# Altium project RFSoC-AMC.PrjPCB (part 2 of 22)

## Sheet DDR4_SDRAM.SchDoc: RFSoC AMC
size 420 x 297 mm; CompanyName: WUT; DrawnBy: T. Przywozki; Organization: WUT ISE; Address1: Warsaw University of Technology; Address2: Nowowiejska 15/19 00-665 Warsaw; Address3: Tomasz.Przywozki@pw.edu.pl; DocumentNumber: 14; Revision: 1; SheetNumber: 14; SheetTotal: 45; Project: RFSoC AMC; ModifiedBy: T. Przywozki; CreateDate: -; CheckedDate: -; DivGrp: ISE; Designer: T. Przywozki; ModifiedDate: -; ProjectName: ADC/DAC MEZZANINE
Used 3 times, as channels U_DDR4_SDRAM_PL1, U_DDR4_SDRAM_PL2, U_DDR4_SDRAM_PS. Parts and nets are listed once, with the designators drawn on the sheet.
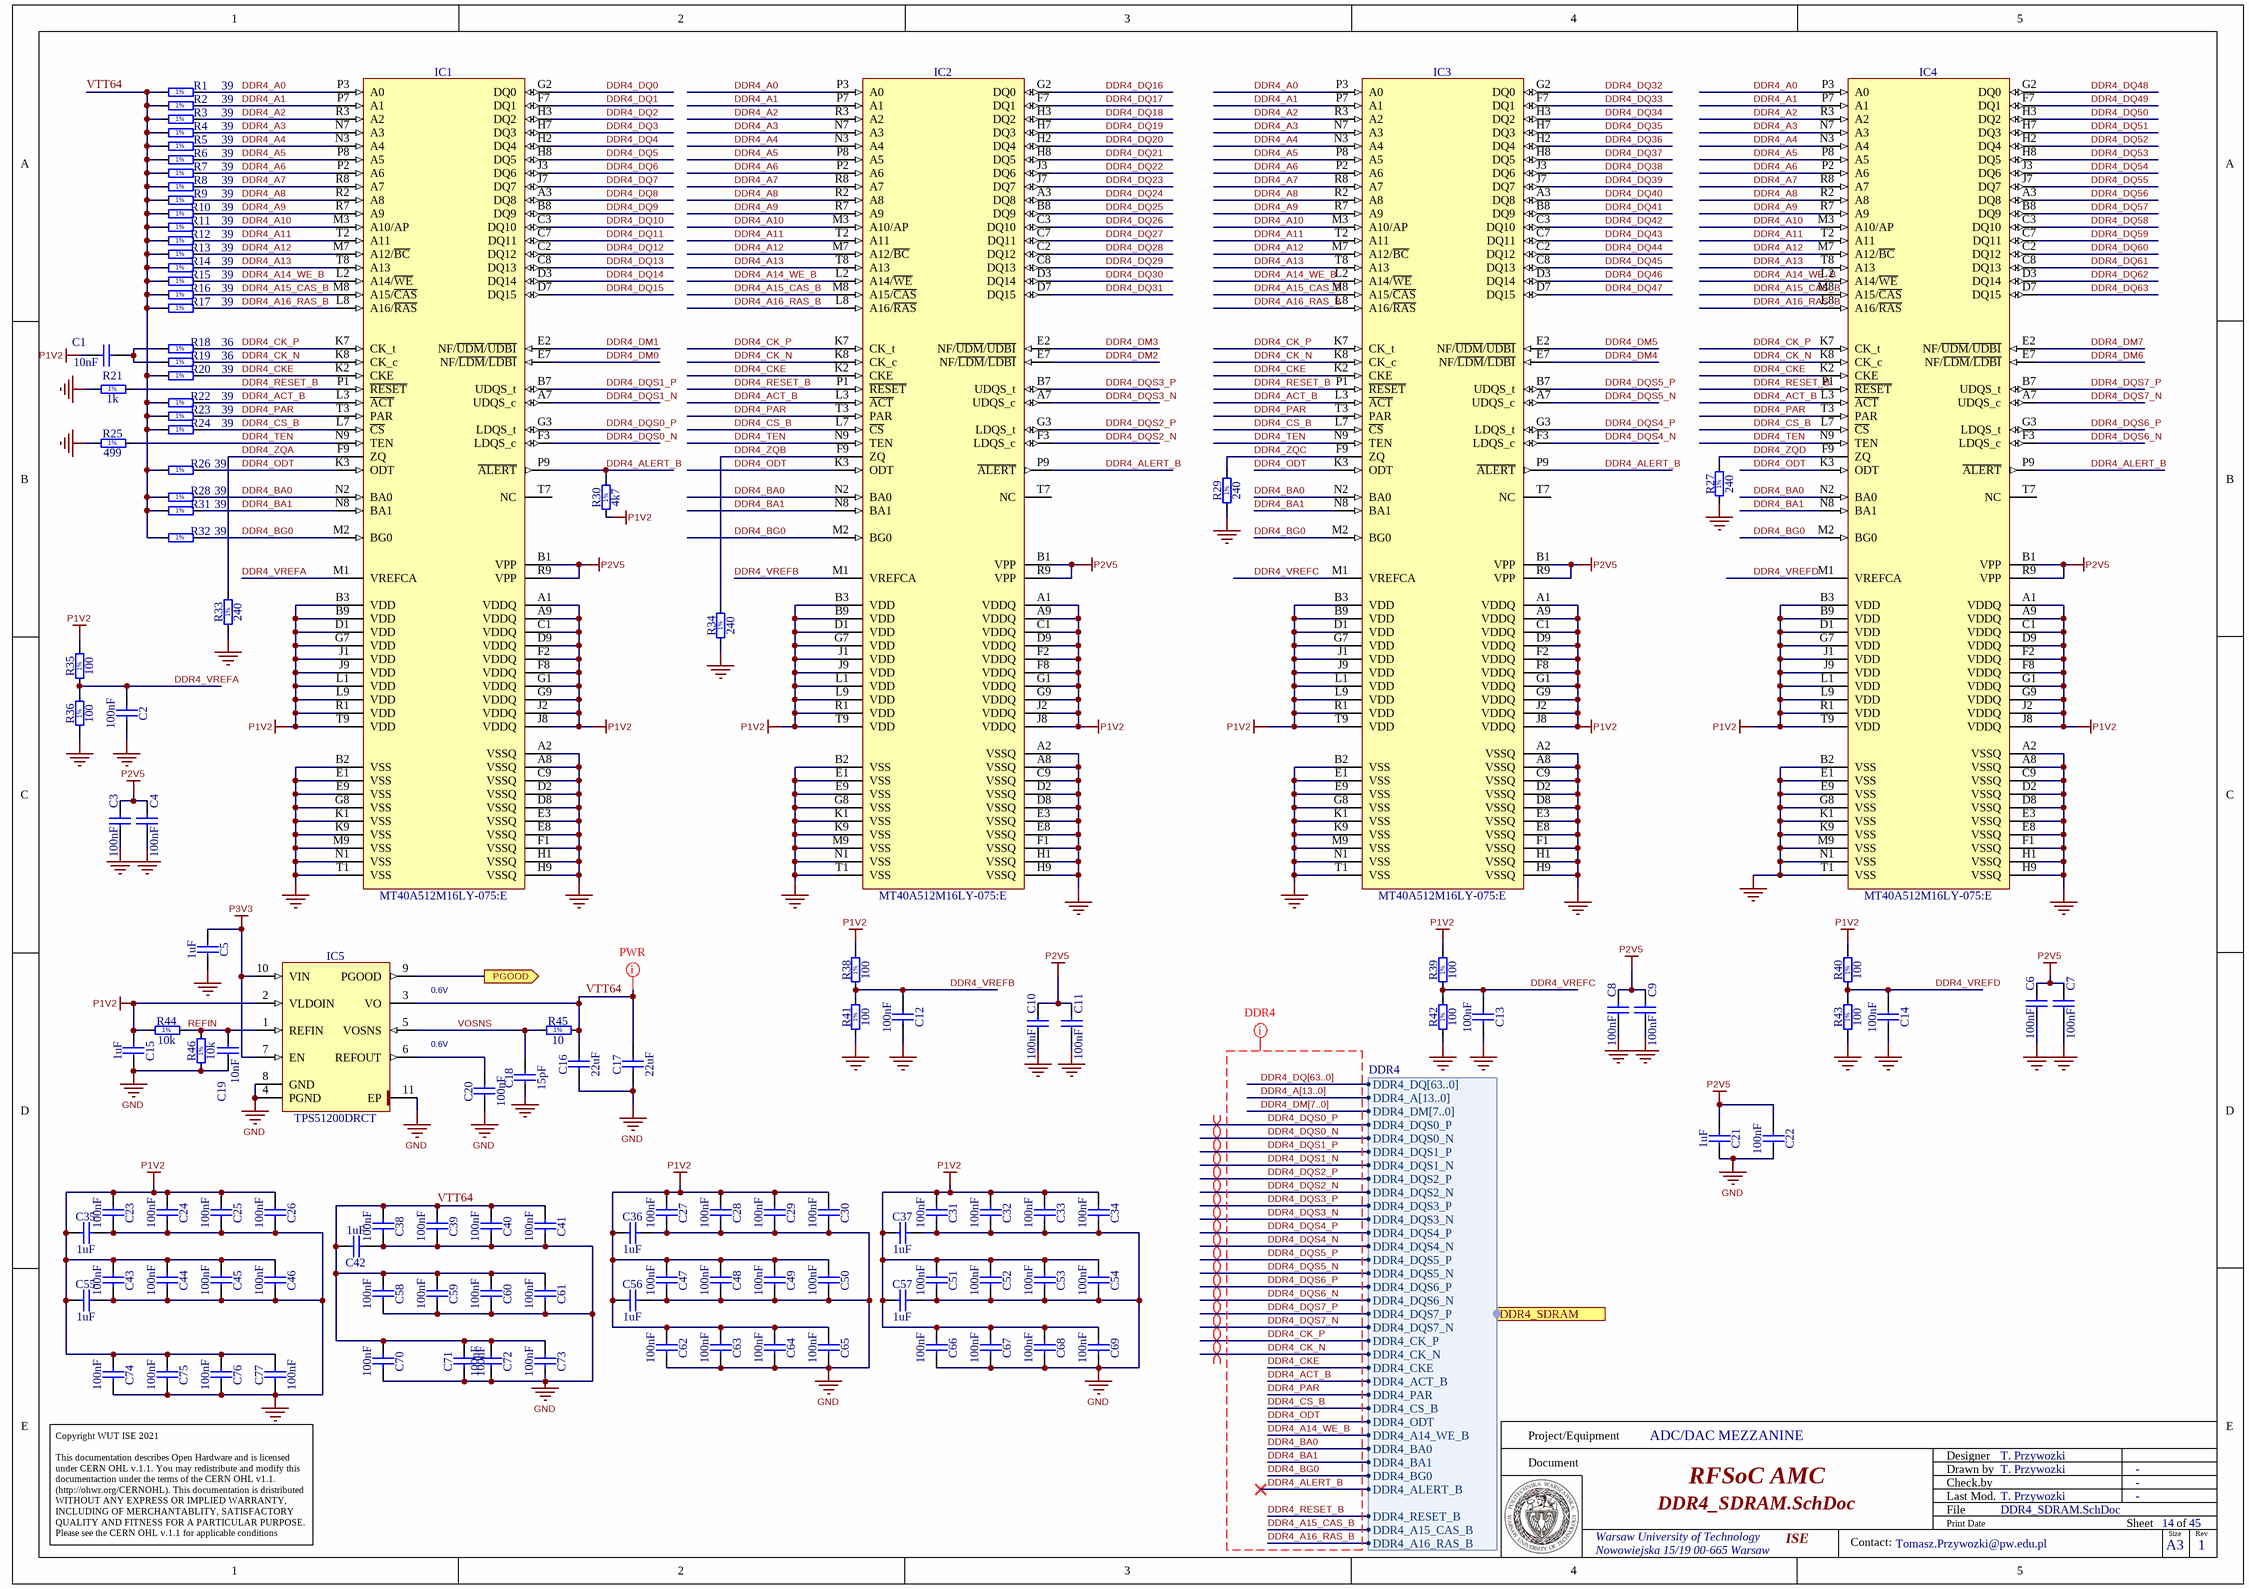
[diagram p2: DDR4_SDRAM.SchDoc]

### Parts
C1  10nF  [CAPC0603X33N]
C2  100nF  [CAPC0603X33N]
C3  100nF  [CAPC0603X33N]
C4  100nF  [CAPC0603X33N]
C5  1uF  [CAPC1005X55N]
C6  100nF  [CAPC0603X33N]
C7  100nF  [CAPC0603X33N]
C8  100nF  [CAPC0603X33N]
C9  100nF  [CAPC0603X33N]
C10  100nF  [CAPC0603X33N]
C11  100nF  [CAPC0603X33N]
C12  100nF  [CAPC0603X33N]
C13  100nF  [CAPC0603X33N]
C14  100nF  [CAPC0603X33N]
C15  1uF  [CAPC1005X55N]
C16  22uF  [CAPC2012X135N]
C17  22uF  [CAPC2012X135N]
C18  15pF  [CAPC1005X55N]
C19  10nF  [CAPC1005X55N]
C20  100nF  [CAPC0603X33N]
C21  1uF  [CAPC1005X55N]
C22  100nF  [CAPC0603X33N]
C23  100nF  [CAPC0603X33N]
C24  100nF  [CAPC0603X33N]
C25  100nF  [CAPC0603X33N]
C26  100nF  [CAPC0603X33N]
C27  100nF  [CAPC0603X33N]
C28  100nF  [CAPC0603X33N]
C29  100nF  [CAPC0603X33N]
C30  100nF  [CAPC0603X33N]
C31  100nF  [CAPC0603X33N]
C32  100nF  [CAPC0603X33N]
C33  100nF  [CAPC0603X33N]
C34  100nF  [CAPC0603X33N]
C35  1uF  [CAPC1005X55N]
C36  1uF  [CAPC1005X55N]
C37  1uF  [CAPC1005X55N]
C38  100nF  [CAPC0603X33N]
C39  100nF  [CAPC0603X33N]
C40  100nF  [CAPC0603X33N]
C41  100nF  [CAPC0603X33N]
C42  1uF  [CAPC1005X55N]
C43  100nF  [CAPC0603X33N]
C44  100nF  [CAPC0603X33N]
C45  100nF  [CAPC0603X33N]
C46  100nF  [CAPC0603X33N]
C47  100nF  [CAPC0603X33N]
C48  100nF  [CAPC0603X33N]
C49  100nF  [CAPC0603X33N]
C50  100nF  [CAPC0603X33N]
C51  100nF  [CAPC0603X33N]
C52  100nF  [CAPC0603X33N]
C53  100nF  [CAPC0603X33N]
C54  100nF  [CAPC0603X33N]
C55  1uF  [CAPC1005X55N]
C56  1uF  [CAPC1005X55N]
C57  1uF  [CAPC1005X55N]
C58  100nF  [CAPC0603X33N]
C59  100nF  [CAPC0603X33N]
C60  100nF  [CAPC0603X33N]
C61  100nF  [CAPC0603X33N]
C62  100nF  [CAPC0603X33N]
C63  100nF  [CAPC0603X33N]
C64  100nF  [CAPC0603X33N]
C65  100nF  [CAPC0603X33N]
C66  100nF  [CAPC0603X33N]
C67  100nF  [CAPC0603X33N]
C68  100nF  [CAPC0603X33N]
C69  100nF  [CAPC0603X33N]
C70  100nF  [CAPC0603X33N]
C71  100nF  [CAPC0603X33N]
C72  100nF  [CAPC0603X33N]
C73  100nF  [CAPC0603X33N]
C74  100nF  [CAPC0603X33N]
C75  100nF  [CAPC0603X33N]
C76  100nF  [CAPC0603X33N]
C77  100nF  [CAPC0603X33N]
IC1  MT40A512M16LY-075:E  [BGA96C80P9X16_750X1350X120]
IC2  MT40A512M16LY-075:E  [BGA96C80P9X16_750X1350X120]
IC3  MT40A512M16LY-075:E  [BGA96C80P9X16_750X1350X120]
IC4  MT40A512M16LY-075:E  [BGA96C80P9X16_750X1350X120]
IC5  TPS51200DRCT  [TEXAS_DRC (S-PVSON-N10)]
R1  39  [RESC1005X40N]
R2  39  [RESC1005X40N]
R3  39  [RESC1005X40N]
R4  39  [RESC1005X40N]
R5  39  [RESC1005X40N]
R6  39  [RESC1005X40N]
R7  39  [RESC1005X40N]
R8  39  [RESC1005X40N]
R9  39  [RESC1005X40N]
R10  39  [RESC1005X40N]
R11  39  [RESC1005X40N]
R12  39  [RESC1005X40N]
R13  39  [RESC1005X40N]
R14  39  [RESC1005X40N]
R15  39  [RESC1005X40N]
R16  39  [RESC1005X40N]
R17  39  [RESC1005X40N]
R18  36  [RESC1005X40N]
R19  36  [RESC1005X40N]
R20  39  [RESC1005X40N]
R21  1k  [RESC1005X40N]
R22  39  [RESC1005X40N]
R23  39  [RESC1005X40N]
R24  39  [RESC1005X40N]
R25  499  [RESC1005X40N]
R26  39  [RESC1005X40N]
R27  240  [RESC1005X40N]
R28  39  [RESC1005X40N]
R29  240  [RESC1005X40N]
R30  4k7  [RESC1005X40N]
R31  39  [RESC1005X40N]
R32  39  [RESC1005X40N]
R33  240  [RESC1005X40N]
R34  240  [RESC1005X40N]
R35  100  [RESC1005X40N]
R36  100  [RESC1005X40N]
R38  100  [RESC1005X40N]
R39  100  [RESC1005X40N]
R40  100  [RESC1005X40N]
R41  100  [RESC1005X40N]
R42  100  [RESC1005X40N]
R43  100  [RESC1005X40N]
R44  10k  [RESC1005X40N]
R45  10  [RESC1005X40N]
R46  10k  [RESC1005X40N]

### Ports
DDR4_SDRAM (harness DDR4), PGOOD (out)

### Harnesses
DDR4: DDR4_DQ[63..0], DDR4_A[13..0], DDR4_DM[7..0], DDR4_DQS0_P, DDR4_DQS0_N, DDR4_DQS1_P, DDR4_DQS1_N, DDR4_DQS2_P, DDR4_DQS2_N, DDR4_DQS3_P, DDR4_DQS3_N, DDR4_DQS4_P, DDR4_DQS4_N, DDR4_DQS5_P, DDR4_DQS5_N, DDR4_DQS6_P, DDR4_DQS6_N, DDR4_DQS7_P, DDR4_DQS7_N, DDR4_CK_P, DDR4_CK_N, DDR4_CKE, DDR4_ACT_B, DDR4_PAR, DDR4_CS_B, DDR4_ODT, DDR4_A14_WE_B, DDR4_BA0, DDR4_BA1, DDR4_BG0, DDR4_ALERT_B, DDR4_RESET_B, DDR4_A15_CAS_B, DDR4_A16_RAS_B

### Nets
GND: C2.2 C3.2 C4.2 C5.2 C6.2 C7.2 C8.2 C9.2 C10.2 C11.2 C12.2 C13.2 C14.2 C15.2 C16.1 C17.1 C18.1 C19.1 C20.1 C21.2 C22.2 C23.2 C24.2 C25.2 C26.2 C27.2 C28.2 C29.2 C30.2 C31.2 C32.2 C33.2 C34.2 C35.2 C36.2 C37.2 C38.2 C39.2 C40.2 C41.2 C42.2 C43.2 C44.2 C45.2 C46.2 C47.2 C48.2 C49.2 C50.2 C51.2 C52.2 C53.2 C54.2 C55.2 C56.2 C57.2 C58.2 C59.2 C60.2 C61.2 C62.2 C63.2 C64.2 C65.2 C66.2 C67.2 C68.2 C69.2 C70.2 C71.2 C72.2 C73.2 C74.2 C75.2 C76.2 C77.1 IC1.A2(VSSQ) IC1.A8(VSSQ) IC1.B2(VSS) IC1.C9(VSSQ) IC1.D2(VSSQ) IC1.D8(VSSQ) IC1.E1(VSS) IC1.E3(VSSQ) IC1.E8(VSSQ) IC1.E9(VSS) IC1.F1(VSSQ) IC1.G8(VSS) IC1.H1(VSSQ) IC1.H9(VSSQ) IC1.K1(VSS) IC1.K9(VSS) IC1.M9(VSS) IC1.N1(VSS) IC1.T1(VSS) IC2.A2(VSSQ) IC2.A8(VSSQ) IC2.B2(VSS) IC2.C9(VSSQ) IC2.D2(VSSQ) IC2.D8(VSSQ) IC2.E1(VSS) IC2.E3(VSSQ) IC2.E8(VSSQ) IC2.E9(VSS) IC2.F1(VSSQ) IC2.G8(VSS) IC2.H1(VSSQ) IC2.H9(VSSQ) IC2.K1(VSS) IC2.K9(VSS) IC2.M9(VSS) IC2.N1(VSS) IC2.T1(VSS) IC3.A2(VSSQ) IC3.A8(VSSQ) IC3.B2(VSS) IC3.C9(VSSQ) IC3.D2(VSSQ) IC3.D8(VSSQ) IC3.E1(VSS) IC3.E3(VSSQ) IC3.E8(VSSQ) IC3.E9(VSS) IC3.F1(VSSQ) IC3.G8(VSS) IC3.H1(VSSQ) IC3.H9(VSSQ) IC3.K1(VSS) IC3.K9(VSS) IC3.M9(VSS) IC3.N1(VSS) IC3.T1(VSS) IC4.A2(VSSQ) IC4.A8(VSSQ) IC4.B2(VSS) IC4.C9(VSSQ) IC4.D2(VSSQ) IC4.D8(VSSQ) IC4.E1(VSS) IC4.E3(VSSQ) IC4.E8(VSSQ) IC4.E9(VSS) IC4.F1(VSSQ) IC4.G8(VSS) IC4.H1(VSSQ) IC4.H9(VSSQ) IC4.K1(VSS) IC4.K9(VSS) IC4.M9(VSS) IC4.N1(VSS) IC4.T1(VSS) IC5.4(PGND) IC5.8(GND) IC5.11(EP) R21.1 R25.1 R27.1 R29.1 R33.1 R34.1 R36.1 R41.1 R42.1 R43.1 R46.1
P1V2: C1.1 C15.1 C23.1 C24.1 C25.1 C26.1 C27.1 C28.1 C29.1 C30.1 C31.1 C32.1 C33.1 C34.1 C35.1 C36.1 C37.1 C43.1 C44.1 C45.1 C46.1 C47.1 C48.1 C49.1 C50.1 C51.1 C52.1 C53.1 C54.1 C55.1 C56.1 C57.1 C62.1 C63.1 C64.1 C65.1 C66.1 C67.1 C68.1 C69.1 C74.1 C75.1 C76.1 C77.2 IC1.A1(VDDQ) IC1.A9(VDDQ) IC1.B3(VDD) IC1.B9(VDD) IC1.C1(VDDQ) IC1.D1(VDD) IC1.D9(VDDQ) IC1.F2(VDDQ) IC1.F8(VDDQ) IC1.G1(VDDQ) IC1.G7(VDD) IC1.G9(VDDQ) IC1.J1(VDD) IC1.J2(VDDQ) IC1.J8(VDDQ) IC1.J9(VDD) IC1.L1(VDD) IC1.L9(VDD) IC1.R1(VDD) IC1.T9(VDD) IC2.A1(VDDQ) IC2.A9(VDDQ) IC2.B3(VDD) IC2.B9(VDD) IC2.C1(VDDQ) IC2.D1(VDD) IC2.D9(VDDQ) IC2.F2(VDDQ) IC2.F8(VDDQ) IC2.G1(VDDQ) IC2.G7(VDD) IC2.G9(VDDQ) IC2.J1(VDD) IC2.J2(VDDQ) IC2.J8(VDDQ) IC2.J9(VDD) IC2.L1(VDD) IC2.L9(VDD) IC2.R1(VDD) IC2.T9(VDD) IC3.A1(VDDQ) IC3.A9(VDDQ) IC3.B3(VDD) IC3.B9(VDD) IC3.C1(VDDQ) IC3.D1(VDD) IC3.D9(VDDQ) IC3.F2(VDDQ) IC3.F8(VDDQ) IC3.G1(VDDQ) IC3.G7(VDD) IC3.G9(VDDQ) IC3.J1(VDD) IC3.J2(VDDQ) IC3.J8(VDDQ) IC3.J9(VDD) IC3.L1(VDD) IC3.L9(VDD) IC3.R1(VDD) IC3.T9(VDD) IC4.A1(VDDQ) IC4.A9(VDDQ) IC4.B3(VDD) IC4.B9(VDD) IC4.C1(VDDQ) IC4.D1(VDD) IC4.D9(VDDQ) IC4.F2(VDDQ) IC4.F8(VDDQ) IC4.G1(VDDQ) IC4.G7(VDD) IC4.G9(VDDQ) IC4.J1(VDD) IC4.J2(VDDQ) IC4.J8(VDDQ) IC4.J9(VDD) IC4.L1(VDD) IC4.L9(VDD) IC4.R1(VDD) IC4.T9(VDD) IC5.2(VLDOIN) R30.1 R35.2 R38.2 R39.2 R40.2 R44.1
P2V5: C3.1 C4.1 C6.1 C7.1 C8.1 C9.1 C10.1 C11.1 C21.1 C22.1 IC1.B1(VPP) IC1.R9(VPP) IC2.B1(VPP) IC2.R9(VPP) IC3.B1(VPP) IC3.R9(VPP) IC4.B1(VPP) IC4.R9(VPP)
P3V3: C5.1 IC5.7(EN) IC5.10(VIN)
DDR4_A0: IC1.P3(A0) IC2.P3(A0) IC3.P3(A0) IC4.P3(A0) R1.2
DDR4_A1: IC1.P7(A1) IC2.P7(A1) IC3.P7(A1) IC4.P7(A1) R2.2
DDR4_A2: IC1.R3(A2) IC2.R3(A2) IC3.R3(A2) IC4.R3(A2) R3.2
DDR4_A3: IC1.N7(A3) IC2.N7(A3) IC3.N7(A3) IC4.N7(A3) R4.2
DDR4_A4: IC1.N3(A4) IC2.N3(A4) IC3.N3(A4) IC4.N3(A4) R5.2
DDR4_A5: IC1.P8(A5) IC2.P8(A5) IC3.P8(A5) IC4.P8(A5) R6.2
DDR4_A6: IC1.P2(A6) IC2.P2(A6) IC3.P2(A6) IC4.P2(A6) R7.2
DDR4_A7: IC1.R8(A7) IC2.R8(A7) IC3.R8(A7) IC4.R8(A7) R8.2
DDR4_A8: IC1.R2(A8) IC2.R2(A8) IC3.R2(A8) IC4.R2(A8) R9.2
DDR4_A9: IC1.R7(A9) IC2.R7(A9) IC3.R7(A9) IC4.R7(A9) R10.2
DDR4_A10: IC1.M3(A10/AP) IC2.M3(A10/AP) IC3.M3(A10/AP) IC4.M3(A10/AP) R11.2
DDR4_A11: IC1.T2(A11) IC2.T2(A11) IC3.T2(A11) IC4.T2(A11) R12.2
DDR4_A12: IC1.M7(A12/~{BC}) IC2.M7(A12/~{BC}) IC3.M7(A12/~{BC}) IC4.M7(A12/~{BC}) R13.2
DDR4_A13: IC1.T8(A13) IC2.T8(A13) IC3.T8(A13) IC4.T8(A13) R14.2
DDR4_A14_WE_B: IC1.L2(A14/~{WE}) IC2.L2(A14/~{WE}) IC3.L2(A14/~{WE}) IC4.L2(A14/~{WE}) R15.2 ; port DDR4_SDRAM.DDR4_A14_WE_B
DDR4_A15_CAS_B: IC1.M8(A15/~{CAS}) IC2.M8(A15/~{CAS}) IC3.M8(A15/~{CAS}) IC4.M8(A15/~{CAS}) R16.2 ; port DDR4_SDRAM.DDR4_A15_CAS_B
DDR4_A16_RAS_B: IC1.L8(A16/~{RAS}) IC2.L8(A16/~{RAS}) IC3.L8(A16/~{RAS}) IC4.L8(A16/~{RAS}) R17.2 ; port DDR4_SDRAM.DDR4_A16_RAS_B
DDR4_ACT_B: IC1.L3(~{ACT}) IC2.L3(~{ACT}) IC3.L3(~{ACT}) IC4.L3(~{ACT}) R22.2 ; port DDR4_SDRAM.DDR4_ACT_B
DDR4_ALERT_B: IC1.P9(~{ALERT}) IC2.P9(~{ALERT}) IC3.P9(~{ALERT}) IC4.P9(~{ALERT}) R30.2 ; port DDR4_SDRAM.DDR4_ALERT_B
DDR4_BA0: IC1.N2(BA0) IC2.N2(BA0) IC3.N2(BA0) IC4.N2(BA0) R28.2 ; port DDR4_SDRAM.DDR4_BA0
DDR4_BA1: IC1.N8(BA1) IC2.N8(BA1) IC3.N8(BA1) IC4.N8(BA1) R31.2 ; port DDR4_SDRAM.DDR4_BA1
DDR4_BG0: IC1.M2(BG0) IC2.M2(BG0) IC3.M2(BG0) IC4.M2(BG0) R32.2 ; port DDR4_SDRAM.DDR4_BG0
DDR4_CK_N: IC1.K8(CK_c) IC2.K8(CK_c) IC3.K8(CK_c) IC4.K8(CK_c) R19.2 ; port DDR4_SDRAM.DDR4_CK_N
DDR4_CK_P: IC1.K7(CK_t) IC2.K7(CK_t) IC3.K7(CK_t) IC4.K7(CK_t) R18.2 ; port DDR4_SDRAM.DDR4_CK_P
DDR4_CKE: IC1.K2(CKE) IC2.K2(CKE) IC3.K2(CKE) IC4.K2(CKE) R20.2 ; port DDR4_SDRAM.DDR4_CKE
DDR4_CS_B: IC1.L7(~{CS}) IC2.L7(~{CS}) IC3.L7(~{CS}) IC4.L7(~{CS}) R24.2 ; port DDR4_SDRAM.DDR4_CS_B
DDR4_DM0: IC1.E7(NF/~{LDM}/~{LDBI})
DDR4_DM1: IC1.E2(NF/~{UDM}/~{UDBI})
DDR4_DM2: IC2.E7(NF/~{LDM}/~{LDBI})
DDR4_DM3: IC2.E2(NF/~{UDM}/~{UDBI})
DDR4_DM4: IC3.E7(NF/~{LDM}/~{LDBI})
DDR4_DM5: IC3.E2(NF/~{UDM}/~{UDBI})
DDR4_DM6: IC4.E7(NF/~{LDM}/~{LDBI})
DDR4_DM7: IC4.E2(NF/~{UDM}/~{UDBI})
DDR4_DQ0: IC1.G2(DQ0)
DDR4_DQ1: IC1.F7(DQ1)
DDR4_DQ2: IC1.H3(DQ2)
DDR4_DQ3: IC1.H7(DQ3)
DDR4_DQ4: IC1.H2(DQ4)
DDR4_DQ5: IC1.H8(DQ5)
DDR4_DQ6: IC1.J3(DQ6)
DDR4_DQ7: IC1.J7(DQ7)
DDR4_DQ8: IC1.A3(DQ8)
DDR4_DQ9: IC1.B8(DQ9)
DDR4_DQ10: IC1.C3(DQ10)
DDR4_DQ11: IC1.C7(DQ11)
DDR4_DQ12: IC1.C2(DQ12)
DDR4_DQ13: IC1.C8(DQ13)
DDR4_DQ14: IC1.D3(DQ14)
DDR4_DQ15: IC1.D7(DQ15)
DDR4_DQ16: IC2.G2(DQ0)
DDR4_DQ17: IC2.F7(DQ1)
DDR4_DQ18: IC2.H3(DQ2)
DDR4_DQ19: IC2.H7(DQ3)
DDR4_DQ20: IC2.H2(DQ4)
DDR4_DQ21: IC2.H8(DQ5)
DDR4_DQ22: IC2.J3(DQ6)
DDR4_DQ23: IC2.J7(DQ7)
DDR4_DQ24: IC2.A3(DQ8)
DDR4_DQ25: IC2.B8(DQ9)
DDR4_DQ26: IC2.C3(DQ10)
DDR4_DQ27: IC2.C7(DQ11)
DDR4_DQ28: IC2.C2(DQ12)
DDR4_DQ29: IC2.C8(DQ13)
DDR4_DQ30: IC2.D3(DQ14)
DDR4_DQ31: IC2.D7(DQ15)
DDR4_DQ32: IC3.G2(DQ0)
DDR4_DQ33: IC3.F7(DQ1)
DDR4_DQ34: IC3.H3(DQ2)
DDR4_DQ35: IC3.H7(DQ3)
DDR4_DQ36: IC3.H2(DQ4)
DDR4_DQ37: IC3.H8(DQ5)
DDR4_DQ38: IC3.J3(DQ6)
DDR4_DQ39: IC3.J7(DQ7)
DDR4_DQ40: IC3.A3(DQ8)
DDR4_DQ41: IC3.B8(DQ9)
DDR4_DQ42: IC3.C3(DQ10)
DDR4_DQ43: IC3.C7(DQ11)
DDR4_DQ44: IC3.C2(DQ12)
DDR4_DQ45: IC3.C8(DQ13)
DDR4_DQ46: IC3.D3(DQ14)
DDR4_DQ47: IC3.D7(DQ15)
DDR4_DQ48: IC4.G2(DQ0)
DDR4_DQ49: IC4.F7(DQ1)
DDR4_DQ50: IC4.H3(DQ2)
DDR4_DQ51: IC4.H7(DQ3)
DDR4_DQ52: IC4.H2(DQ4)
DDR4_DQ53: IC4.H8(DQ5)
DDR4_DQ54: IC4.J3(DQ6)
DDR4_DQ55: IC4.J7(DQ7)
DDR4_DQ56: IC4.A3(DQ8)
DDR4_DQ57: IC4.B8(DQ9)
DDR4_DQ58: IC4.C3(DQ10)
DDR4_DQ59: IC4.C7(DQ11)
DDR4_DQ60: IC4.C2(DQ12)
DDR4_DQ61: IC4.C8(DQ13)
DDR4_DQ62: IC4.D3(DQ14)
DDR4_DQ63: IC4.D7(DQ15)
DDR4_DQS0_N: IC1.F3(LDQS_c) ; port DDR4_SDRAM.DDR4_DQS0_N
DDR4_DQS0_P: IC1.G3(LDQS_t) ; port DDR4_SDRAM.DDR4_DQS0_P
DDR4_DQS1_N: IC1.A7(UDQS_c) ; port DDR4_SDRAM.DDR4_DQS1_N
DDR4_DQS1_P: IC1.B7(UDQS_t) ; port DDR4_SDRAM.DDR4_DQS1_P
DDR4_DQS2_N: IC2.F3(LDQS_c) ; port DDR4_SDRAM.DDR4_DQS2_N
DDR4_DQS2_P: IC2.G3(LDQS_t) ; port DDR4_SDRAM.DDR4_DQS2_P
DDR4_DQS3_N: IC2.A7(UDQS_c) ; port DDR4_SDRAM.DDR4_DQS3_N
DDR4_DQS3_P: IC2.B7(UDQS_t) ; port DDR4_SDRAM.DDR4_DQS3_P
DDR4_DQS4_N: IC3.F3(LDQS_c) ; port DDR4_SDRAM.DDR4_DQS4_N
DDR4_DQS4_P: IC3.G3(LDQS_t) ; port DDR4_SDRAM.DDR4_DQS4_P
DDR4_DQS5_N: IC3.A7(UDQS_c) ; port DDR4_SDRAM.DDR4_DQS5_N
DDR4_DQS5_P: IC3.B7(UDQS_t) ; port DDR4_SDRAM.DDR4_DQS5_P
DDR4_DQS6_N: IC4.F3(LDQS_c) ; port DDR4_SDRAM.DDR4_DQS6_N
DDR4_DQS6_P: IC4.G3(LDQS_t) ; port DDR4_SDRAM.DDR4_DQS6_P
DDR4_DQS7_N: IC4.A7(UDQS_c) ; port DDR4_SDRAM.DDR4_DQS7_N
DDR4_DQS7_P: IC4.B7(UDQS_t) ; port DDR4_SDRAM.DDR4_DQS7_P
DDR4_ODT: IC1.K3(ODT) IC2.K3(ODT) IC3.K3(ODT) IC4.K3(ODT) R26.2 ; port DDR4_SDRAM.DDR4_ODT
DDR4_PAR: IC1.T3(PAR) IC2.T3(PAR) IC3.T3(PAR) IC4.T3(PAR) R23.2 ; port DDR4_SDRAM.DDR4_PAR
DDR4_RESET_B: IC1.P1(~{RESET}) IC2.P1(~{RESET}) IC3.P1(~{RESET}) IC4.P1(~{RESET}) R21.2 ; port DDR4_SDRAM.DDR4_RESET_B
DDR4_TEN: IC1.N9(TEN) IC2.N9(TEN) IC3.N9(TEN) IC4.N9(TEN) R25.2
DDR4_VREFA: C2.1 IC1.M1(VREFCA) R35.1 R36.2
DDR4_VREFB: C12.1 IC2.M1(VREFCA) R38.1 R41.2
DDR4_VREFC: C13.1 IC3.M1(VREFCA) R39.1 R42.2
DDR4_VREFD: C14.1 IC4.M1(VREFCA) R40.1 R43.2
DDR4_ZQA: IC1.F9(ZQ) R33.2
DDR4_ZQB: IC2.F9(ZQ) R34.2
DDR4_ZQC: IC3.F9(ZQ) R29.2
DDR4_ZQD: IC4.F9(ZQ) R27.2
PGOOD: IC5.9(PGOOD) ; port PGOOD
REFIN: C19.2 IC5.1(REFIN) R44.2 R46.2
VOSNS: C18.2 IC5.5(VOSNS) R45.1
VTT64: C16.2 C17.2 C38.1 C39.1 C40.1 C41.1 C42.1 C58.1 C59.1 C60.1 C61.1 C70.1 C71.1 C72.1 C73.1 IC5.3(VO) R1.1 R2.1 R3.1 R4.1 R5.1 R6.1 R7.1 R8.1 R9.1 R10.1 R11.1 R12.1 R13.1 R14.1 R15.1 R16.1 R17.1 R20.1 R22.1 R23.1 R24.1 R26.1 R28.1 R31.1 R32.1 R45.2
NetC1_2: C1.2 R18.1 R19.1
NetC20_2: C20.2 IC5.6(REFOUT)

Not connected (* = marked no-connect by the designer): IC1 T7(NC); IC2 T7(NC); IC3 T7(NC); IC4 T7(NC)

### Channels
U_DDR4_SDRAM_PL1: designators end in _U_DDR4_SDRAM_PL1; ports PGOOD=NetIC5_U_DDR4_SDRAM_PL1_9
U_DDR4_SDRAM_PL2: designators end in _U_DDR4_SDRAM_PL2; ports PGOOD=NetIC5_U_DDR4_SDRAM_PL1_9
U_DDR4_SDRAM_PS: designators end in _U_DDR4_SDRAM_PS; ports PGOOD=NetIC5_U_DDR4_SDRAM_PL1_9

### Buses and harness runs
bus DDR4_A[13..0]
bus DDR4_DM[7..0]
bus DDR4_DQ[63..0]

### Layout directives
differential pair; differential pair class DDR_DIFF: DDR4_PL0.DDR4_CK_N, DDR4_PL0.DDR4_CK_P, DDR4_PL0.DDR4_DQS0_N, DDR4_PL0.DDR4_DQS0_P, DDR4_PL0.DDR4_DQS1_N, DDR4_PL0.DDR4_DQS1_P, DDR4_PL0.DDR4_DQS2_N, DDR4_PL0.DDR4_DQS2_P, DDR4_PL0.DDR4_DQS3_N, DDR4_PL0.DDR4_DQS3_P, DDR4_PL0.DDR4_DQS4_N, DDR4_PL0.DDR4_DQS4_P, DDR4_PL0.DDR4_DQS5_N, DDR4_PL0.DDR4_DQS5_P, DDR4_PL0.DDR4_DQS6_N, DDR4_PL0.DDR4_DQS6_P, DDR4_PL0.DDR4_DQS7_N, DDR4_PL0.DDR4_DQS7_P
net class DDR4: DDR4_A14_WE_B, DDR4_A15_CAS_B, DDR4_A16_RAS_B, DDR4_A[13..0], DDR4_ACT_B, DDR4_ALERT_B, DDR4_BA0, DDR4_BA1, DDR4_BG0, DDR4_CK_N, DDR4_CK_P, DDR4_CKE, DDR4_CS_B, DDR4_DM[7..0], DDR4_DQ[63..0], DDR4_DQS0_N, DDR4_DQS0_P, DDR4_DQS1_N, DDR4_DQS1_P, DDR4_DQS2_N, DDR4_DQS2_P, DDR4_DQS3_N, DDR4_DQS3_P, DDR4_DQS4_N, DDR4_DQS4_P, DDR4_DQS5_N, DDR4_DQS5_P, DDR4_DQS6_N, DDR4_DQS6_P, DDR4_DQS7_N, DDR4_DQS7_P, DDR4_ODT, DDR4_PAR, DDR4_RESET_B
net class PWR: VTT64_U_DDR4_SDRAM_PL1

### Notes on the sheet
- (near IC5) 0.6V
- 0.6V
- Project/Equipment
- Document
- Designer
- Drawn by
- Check.by
- Copyright WUT ISE 2021
  This documentation describes Open Hardware and is licensed under CERN OHL v.1.1. You may redistribute and modify this documentaction under the terms of the CERN OHL v1.1.
  (http://ohwr.org/CERNOHL). This documentation is dristributed WITHOUT ANY EXPRESS OR IMPLIED WARRANTY, INCLUDING OF MERCHANTABLITY, SATISFACTORY QUALITY AND FITNESS FOR A PARTICULAR PURPOSE. Please see the CERN OHL v.1.1 for applicable conditions
- File
- Last Mod.
- Print Date
- Sheet
- Size
- A3
- of
- Rev
- Contact:
- (in symbol R0402_1K_1%_0.0625W_100PPM) 1%
- (in symbol R0402_4K7_1%_0.0625W_100PPM) 1%
- (in symbol R0402_10K_1%_0.0625W_100PPM) 1%
- (in symbol R0402_10R_1%_0.0625W_200PPM) 1%
- (in symbol R0402_36R_1%_0.0625W_100PPM) 1%
- (in symbol R0402_39R_1%_0.0625W_100PPM) 1%
- (in symbol R0402_100R_1%_0.0625W_100PPM) 1%
- (in symbol R0402_240R_1%_0.0625W_100PPM) 1%
- (in symbol R0402_499R_1%_0.0625W_100PPM) 1%

### Library data of the parts
C1 = CC0201_10NF_10V_10%_X5R: Non-polarised capacitor; Part Description: SMD Multilayer Chip Ceramic Capacitor; Manufacturer: GENERIC; Manufacturer1 Part Number: 0201ZD103KAT2A; Voltage: 10V; TC: X5R; Tolerance: ±10%; Part Number: CC0201_10NF_10V_10%_X5R; Component Kind: Standard; Component Type: Standard; Pin Count: 2; Value: 10nF; Status: Not Recommended; Manufacturer Part Number: CC0201_10NF_10V_10%_X5R; Case: 0201; Mounted: Yes; Socket: No; SMD: Yes; Sense: No; Manufacturer1 Example: AVX; Manufacturer1 ComponentHeight: 0.33mm; HelpURL: \\cern.ch\dfs\Applications\Altium\Datasheets\CC0201_X5R_AVX.pdf; Author: CERN DEM JLC; CreateDate: 03.12.2007; LatestRevisionDate: 03.12.2007
C2-C4 C6-C14 C20 C22-C34 C38-C41 C43-C54 C58-C77 = CC0201_100NF_6.3V_10%_X5R: Non-polarised capacitor; Manufacturer: GENERIC; Part Description: SMD Multilayer Chip Ceramic Capacitor; Manufacturer1 Part Number: 02016D104KAT2A; Tolerance: ±10%; Voltage: 6.3V; TC: X5R; Manufacturer Part Number: CC0201_100NF_6.3V_10%_X5R; Part Number: CC0201_100NF_6.3V_10%_X5R; Value: 100nF; Component Kind: Standard; Component Type: Standard; Pin Count: 2; Status: Not Recommended; Case: 0201; Mounted: Yes; Socket: No; SMD: Yes; Sense: No; Manufacturer1 Example: AVX; Manufacturer1 ComponentHeight: 0.33mm; HelpURL: \\cern.ch\dfs\Applications\Altium\Datasheets\CC0201_X5R_AVX.pdf; Author: CERN DEM JLC; CreateDate: 03/12/2007; LatestRevisionDate: 03/12/2007
C5 C15 C21 C35-C37 C42 C55-C57 = CC0402_1UF_16V_10%_X5R: Non-polarised capacitor; Manufacturer: GENERIC; Part Description: SMD Multilayer Chip Ceramic Capacitor; Manufacturer1 Part Number: C1005X5R1C105KT; Tolerance: ±10%; Voltage: 16V; TC: X5R; Manufacturer Part Number: CC0402_1UF_16V_10%_X5R; Part Number: CC0402_1UF_16V_10%_X5R; Value: 1uF; Component Kind: Standard; Component Type: Standard; Pin Count: 2; Status: Preferred; Case: 0402; Mounted: Yes; Socket: No; SMD: Yes; Sense: No; Manufacturer1 Example: TDK; Manufacturer1 ComponentHeight: 0.55mm; HelpURL: \\cern.ch\dfs\Applications\Altium\Datasheets\CC0402_X5R_TDK_C.pdf; Author: CERN DEM JLC; CreateDate: 25/10/2012; LatestRevisionDate: 25/10/2012
C16 C17 = CC0805_22UF_10V_+80%-20%_Y5V: Non-polarised capacitor; Manufacturer: GENERIC; Part Description: SMD Multilayer Chip Ceramic Capacitor; Manufacturer1 Part Number: 2222 241 19881; Voltage: 10V; TC: Y5V; Manufacturer Part Number: CC0805_22UF_10V_+80%-20%_Y5V; Part Number: CC0805_22UF_10V_+80%-20%_Y5V; Tolerance: +80% -20%; Value: 22uF; Component Kind: Standard; Component Type: Standard; Pin Count: 2; Status: Preferred; Case: 0805; Mounted: Yes; Socket: No; SMD: Yes; Sense: No; Manufacturer1 Example: PHYCOMP; Manufacturer1 ComponentHeight: 1.45mm; HelpURL: \\cern.ch\dfs\Applications\Altium\Datasheets\CC0805_Y5V_PHYCOMP.pdf; Author: CERN DEM JLC; CreateDate: 03.12.2007; LatestRevisionDate: 03.12.2007
C18 = CC0402_15PF_50V_5%_C0G: Non-polarised capacitor; Manufacturer: GENERIC; Part Description: SMD Multilayer Chip Ceramic Capacitor; Manufacturer1 Part Number: C0402C150J5GACTU; Tolerance: ±5%; Voltage: 50V; TC: C0G/NP0; Manufacturer Part Number: CC0402_15PF_50V_5%_C0G; Part Number: CC0402_15PF_50V_5%_C0G; Value: 15pF; Component Kind: Standard; Component Type: Standard; Pin Count: 2; Status: Preferred; Case: 0402; Mounted: Yes; Socket: No; SMD: Yes; Sense: No; Manufacturer1 Example: KEMET; Manufacturer1 ComponentHeight: 0.55mm; HelpURL: \\cern.ch\dfs\Applications\Altium\Datasheets\CC0805_C0G_KEMET_(Commercial Grade).pdf; Author: CERN DEM JLC; CreateDate: 03.12.2007; LatestRevisionDate: 22.04.2015
C19 = CC0402_10NF_25V_10%_X7R: Non-polarised capacitor; Manufacturer: GENERIC; Part Description: SMD Multilayer Chip Ceramic Capacitor; Manufacturer1 Part Number: C1005X7R1E103KT; Tolerance: ±10%; Voltage: 25V; TC: X7R; Manufacturer Part Number: CC0402_10NF_25V_10%_X7R; Part Number: CC0402_10NF_25V_10%_X7R; Value: 10nF; Component Kind: Standard; Component Type: Standard; Pin Count: 2; Status: Preferred; Case: 0402; Mounted: Yes; Socket: No; SMD: Yes; Sense: No; Manufacturer1 Example: TDK; Manufacturer1 ComponentHeight: 0.55mm; HelpURL: \\cern.ch\dfs\Applications\Altium\Datasheets\CC0402_X7R_TDK_C.pdf; Author: CERN DEM JLC; CreateDate: 25.10.2012; LatestRevisionDate: 25.10.2012
IC1-IC4 = MT40A512M16LY-075:E: +1.2V, 8Gb (512 Meg x 16 x 8 Banks) DDR4 SDRAM; Part Description: +1.2V, 8Gb (512 Meg x 16) Automotive DDR4 SDRAM; Manufacturer: MICRON TECHNOLOGY; PressFit: No; Bonding: No; Part Number: MT40A512M16LY-075:E; Component Kind: Standard; Component Type: Standard; Device: MT40A512M16LY-075:E; PackageDescription: BGA, 0.80mm Pitch, Rect.; 96 Pin, 9 Columns X 16 Rows, Body 13.50mm X 7.50mm X 1.20mm H; Manufacturer Part Number: MT40A512M16LY-075:E; Pin Count: 96; Case: BGA96; Mounted: Yes; Socket: No; SMD: Yes; Sense: No; ComponentHeight: 1.2mm; HelpURL: \\cern.ch\dfs\Applications\Altium\Datasheets\MT40A512M16LY-075-E.pdf; Author: CERN DEM WB; CreateDate: 26.07.2019; LatestRevisionDate: 26.07.2019
IC5 = TPS51200DRCT: Sink/Source DDR Termination Regulator; Manufacturer: TEXAS INSTRUMENTS; Part Description: 3.3V Sink/Source DDR Termination Regulator; PressFit: No; Bonding: No; Manufacturer Part Number: TPS51200DRCT; PackageDescription: SON, 0.50mm Pitch, 10-pin, 3.00mm W  X 3.00mm L X 1.00mm Height, (w/thermal tab 1.75 X 2.50 mm); Part Number: TPS51200DRCT; Component Kind: Standard; Component Type: Standard; Device: TPS51200DRCT; Pin Count: 11; Case: SON10; Mounted: Yes; Socket: No; SMD: Yes; Sense: No; ComponentHeight: 1mm; HelpURL: \\cern.ch\dfs\Applications\Altium\Datasheets\TPS51200DRCT.pdf; Author: CERN DEM JLC; CreateDate: 03/02/2010; LatestRevisionDate: 06/11/2013
R1-R17 R20 R22-R24 R26 R28 R31 R32 = R0402_39R_1%_0.0625W_100PPM: Resistor - 1%; Manufacturer: GENERIC; Part Description: General Purpose Thick Film Chip Resistor; Manufacturer1 Part Number: 232270673909L; TC: ±100ppm/°C; PressFit: No; Manufacturer Part Number: R0402_39R_1%_0.0625W_100PPM; Part Number: R0402_39R_1%_0.0625W_100PPM; Tolerance: ±1%; Value: 39; Component Kind: Standard; Component Type: Standard; Pin Count: 2; Status: Not Recommended; Power: 0.0625W; Case: 0402; Mounted: Yes; Sense: No; Socket: No; SMD: Yes; Manufacturer1 Example: YAGEO PHYCOMP; Manufacturer1 ComponentHeight: 0.4mm; HelpURL: \\cern.ch\dfs\Applications\Altium\Datasheets\R0402_Phycomp_RC0402.pdf; Author: CERN DEM JLC; CreateDate: 03/12/2007; LatestRevisionDate: 17/10/2012
R18 R19 = R0402_36R_1%_0.0625W_100PPM: Resistor - 1%; Manufacturer: GENERIC; Part Description: General Purpose Thick Film Chip Resistor; Manufacturer1 Part Number: 232270673609L; TC: ±100ppm/°C; PressFit: No; Manufacturer Part Number: R0402_36R_1%_0.0625W_100PPM; Part Number: R0402_36R_1%_0.0625W_100PPM; Tolerance: ±1%; Value: 36; Component Kind: Standard; Component Type: Standard; Pin Count: 2; Status: Not Recommended; Power: 0.0625W; Case: 0402; Mounted: Yes; Sense: No; Socket: No; SMD: Yes; Manufacturer1 Example: YAGEO PHYCOMP; Manufacturer1 ComponentHeight: 0.4mm; HelpURL: \\cern.ch\dfs\Applications\Altium\Datasheets\R0402_Phycomp_RC0402.pdf; Author: CERN DEM JLC; CreateDate: 03.12.2007; LatestRevisionDate: 17.10.2012
R21 = R0402_1K_1%_0.0625W_100PPM: Resistor - 1%; Manufacturer: GENERIC; Part Description: General Purpose Thick Film Chip Resistor; Manufacturer1 Part Number: 232270671002L; TC: ±100ppm/°C; PressFit: No; Manufacturer Part Number: R0402_1K_1%_0.0625W_100PPM; Part Number: R0402_1K_1%_0.0625W_100PPM; Tolerance: ±1%; Value: 1k; Component Kind: Standard; Component Type: Standard; Pin Count: 2; Status: Not Recommended; Power: 0.0625W; Case: 0402; Mounted: Yes; Sense: No; Socket: No; SMD: Yes; Manufacturer1 Example: YAGEO PHYCOMP; Manufacturer1 ComponentHeight: 0.4mm; HelpURL: \\cern.ch\dfs\Applications\Altium\Datasheets\R0402_Phycomp_RC0402.pdf; Author: CERN DEM JLC; CreateDate: 03.12.2007; LatestRevisionDate: 17.10.2012
R25 = R0402_499R_1%_0.0625W_100PPM: Resistor - 1%; Part Description: General Purpose Thick Film Chip Resistor; Manufacturer: GENERIC; Manufacturer1 Part Number: CRCW0402499RFK; TC: ±100ppm/°C; PressFit: No; Part Number: R0402_499R_1%_0.0625W_100PPM; Component Kind: Standard; Component Type: Standard; Pin Count: 2; Value: 499; Status: None; Power: 0.0625W; Tolerance: ±1%; Manufacturer Part Number: R0402_499R_1%_0.0625W_100PPM; Case: 0402; Mounted: Yes; Sense: No; Socket: No; SMD: Yes; Manufacturer1 Example: VISHAY; Manufacturer1 ComponentHeight: 0.4mm; HelpURL: \\cern.ch\dfs\Applications\Altium\Datasheets\R0402_VISHAY_CRCW e3.pdf; Author: CERN DEM BC; CreateDate: 27.02.2020; LatestRevisionDate: 27.02.2020
R27 R29 R33 R34 = R0402_240R_1%_0.0625W_100PPM: Resistor - 1%; Manufacturer: GENERIC; Part Description: General Purpose Thick Film Chip Resistor; Manufacturer1 Part Number: 232270672401L; TC: ±100ppm/°C; PressFit: No; Manufacturer Part Number: R0402_240R_1%_0.0625W_100PPM; Part Number: R0402_240R_1%_0.0625W_100PPM; Tolerance: ±1%; Value: 240; Component Kind: Standard; Component Type: Standard; Pin Count: 2; Status: Not Recommended; Power: 0.0625W; Case: 0402; Mounted: Yes; Sense: No; Socket: No; SMD: Yes; Manufacturer1 Example: YAGEO PHYCOMP; Manufacturer1 ComponentHeight: 0.4mm; HelpURL: \\cern.ch\dfs\Applications\Altium\Datasheets\R0402_Phycomp_RC0402.pdf; Author: CERN DEM JLC; CreateDate: 03.12.2007; LatestRevisionDate: 17.10.2012
R30 = R0402_4K7_1%_0.0625W_100PPM: Resistor - 1%; Manufacturer: GENERIC; Part Description: General Purpose Thick Film Chip Resistor; Manufacturer1 Part Number: 232270674702L; TC: ±100ppm/°C; PressFit: No; Manufacturer Part Number: R0402_4K7_1%_0.0625W_100PPM; Part Number: R0402_4K7_1%_0.0625W_100PPM; Tolerance: ±1%; Value: 4k7; Component Kind: Standard; Component Type: Standard; Pin Count: 2; Status: Not Recommended; Power: 0.0625W; Case: 0402; Mounted: Yes; Sense: No; Socket: No; SMD: Yes; Manufacturer1 Example: YAGEO PHYCOMP; Manufacturer1 ComponentHeight: 0.4mm; HelpURL: \\cern.ch\dfs\Applications\Altium\Datasheets\R0402_Phycomp_RC0402.pdf; Author: CERN DEM JLC; CreateDate: 03.12.2007; LatestRevisionDate: 17.10.2012
R35 R36 R38-R43 = R0402_100R_1%_0.0625W_100PPM: Resistor - 1%; Manufacturer: GENERIC; Part Description: General Purpose Thick Film Chip Resistor; Manufacturer1 Part Number: 232270671001L; TC: ±100ppm/°C; PressFit: No; Manufacturer Part Number: R0402_100R_1%_0.0625W_100PPM; Part Number: R0402_100R_1%_0.0625W_100PPM; Tolerance: ±1%; Value: 100; Component Kind: Standard; Component Type: Standard; Pin Count: 2; Status: Not Recommended; Power: 0.0625W; Case: 0402; Mounted: Yes; Sense: No; Socket: No; SMD: Yes; Manufacturer1 Example: YAGEO PHYCOMP; Manufacturer1 ComponentHeight: 0.4mm; HelpURL: \\cern.ch\dfs\Applications\Altium\Datasheets\R0402_Phycomp_RC0402.pdf; Author: CERN DEM JLC; CreateDate: 03.12.2007; LatestRevisionDate: 17.10.2012
R44 R46 = R0402_10K_1%_0.0625W_100PPM: Resistor - 1%; Manufacturer: GENERIC; Part Description: General Purpose Thick Film Chip Resistor; Manufacturer1 Part Number: 232270671003L; TC: ±100ppm/°C; PressFit: No; Manufacturer Part Number: R0402_10K_1%_0.0625W_100PPM; Part Number: R0402_10K_1%_0.0625W_100PPM; Tolerance: ±1%; Value: 10k; Component Kind: Standard; Component Type: Standard; Pin Count: 2; Status: Not Recommended; Power: 0.0625W; Case: 0402; Mounted: Yes; Sense: No; Socket: No; SMD: Yes; Manufacturer1 Example: YAGEO PHYCOMP; Manufacturer1 ComponentHeight: 0.4mm; HelpURL: \\cern.ch\dfs\Applications\Altium\Datasheets\R0402_Phycomp_RC0402.pdf; Author: CERN DEM JLC; CreateDate: 03/12/2007; LatestRevisionDate: 17/10/2012
R45 = R0402_10R_1%_0.0625W_200PPM: Resistor - 1%; Manufacturer: GENERIC; Part Description: General Purpose Thick Film Chip Resistor; Manufacturer1 Part Number: 232270671009L; TC: ±200ppm/°C; PressFit: No; Manufacturer Part Number: R0402_10R_1%_0.0625W_200PPM; Part Number: R0402_10R_1%_0.0625W_200PPM; Tolerance: ±1%; Value: 10; Component Kind: Standard; Component Type: Standard; Pin Count: 2; Status: Not Recommended; Power: 0.0625W; Case: 0402; Mounted: Yes; Sense: No; Socket: No; SMD: Yes; Manufacturer1 Example: YAGEO PHYCOMP; Manufacturer1 ComponentHeight: 0.4mm; HelpURL: \\cern.ch\dfs\Applications\Altium\Datasheets\R0402_Phycomp_RC0402.pdf; Author: CERN DEM JLC; CreateDate: 24.06.2009; LatestRevisionDate: 17.10.2012

## Sheet RFMC_ADC.SchDoc: RFSoC AMC
size 420 x 297 mm; CompanyName: WUT; DrawnBy: T. Przywozki; Organization: WUT ISE; Address1: Warsaw University of Technology; Address2: Nowowiejska 15/19 00-665 Warsaw; Address3: Tomasz.Przywozki@pw.edu.pl; DocumentNumber: 18; Revision: 1; SheetNumber: 18; SheetTotal: 45; Project: RFSoC AMC; ModifiedBy: T. Przywozki; CreateDate: -; CheckedDate: -; DivGrp: ISE; Designer: T. Przywozki; ModifiedDate: -; ProjectName: ADC/DAC MEZZANINE
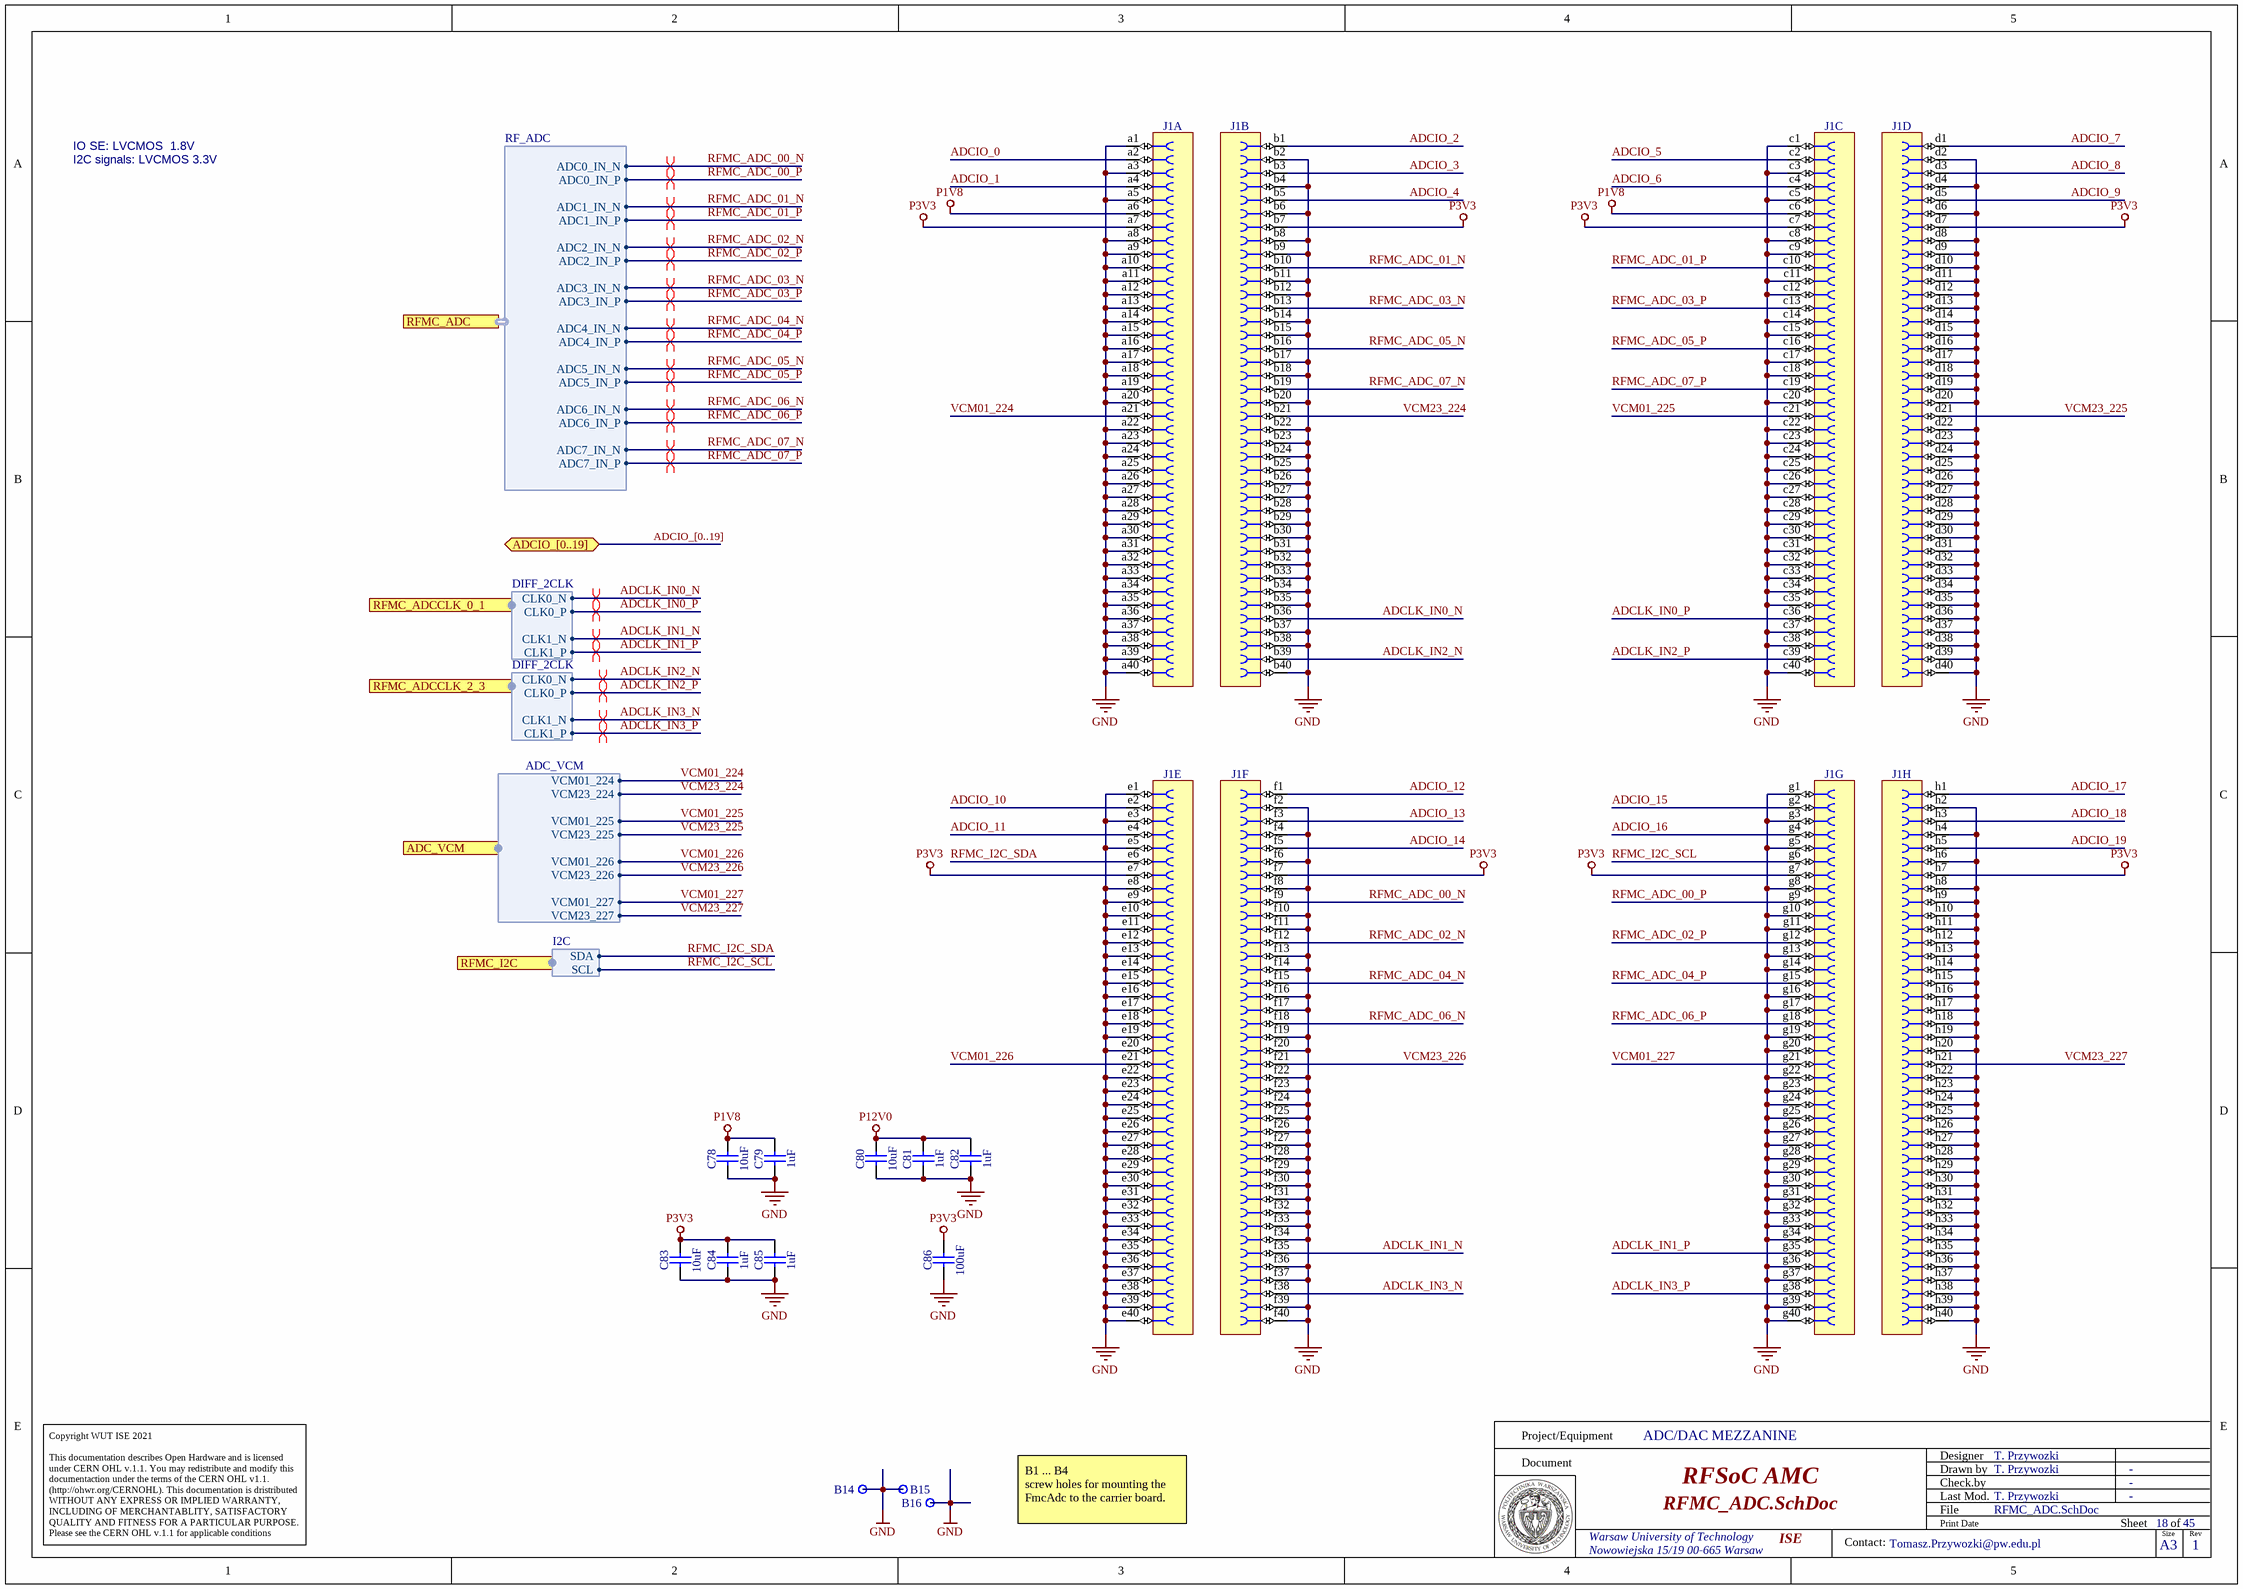
[diagram p3: RFMC_ADC.SchDoc]

### Parts
B14  Plated Hole  [MTG270_500]  (value not drawn)
B15  Plated Hole  [MTG270_500]  (value not drawn)
B16  Plated Hole  [MTG270_500]  (value not drawn)
C78  10uF  [CAPC1608X80N]
C79  1uF  [CAPC1005X55N]
C80  10uF  [CAPC1608X80N]
C81  1uF  [CAPC1005X55N]
C82  1uF  [CAPC1005X55N]
C83  10uF  [CAPC1608X80N]
C84  1uF  [CAPC1005X55N]
C85  1uF  [CAPC1005X55N]
C86  100uF  [CAPC3216X180N]
J1  (no value)  [SAMTEC_LPAF-40-03.0-S-08]  (parts A,B,C,D,E,F,G,H of 8)

### Ports
ADC_VCM (harness ADC_VCM), ADCIO_[0..19] (bidir), RFMC_ADC (harness RF_ADC), RFMC_ADCCLK_0_1 (harness DIFF_2CLK), RFMC_ADCCLK_2_3 (harness DIFF_2CLK), RFMC_I2C (harness I2C)

### Harnesses
RF_ADC: ADC0_IN_N, ADC0_IN_P, ADC1_IN_N, ADC1_IN_P, ADC2_IN_N, ADC2_IN_P, ADC3_IN_N, ADC3_IN_P, ADC4_IN_N, ADC4_IN_P, ADC5_IN_N, ADC5_IN_P, ADC6_IN_N, ADC6_IN_P, ADC7_IN_N, ADC7_IN_P
ADC_VCM: VCM01_224, VCM23_224, VCM23_225, VCM01_226, VCM01_227, VCM23_227, VCM01_225, VCM23_226
DIFF_2CLK: CLK0_P, CLK0_N, CLK1_P, CLK1_N
I2C: SCL, SDA

### Nets
GND: B14.1 B15.1 B16.1 C78.1 C79.2 C80.1 C81.2 C82.2 C83.1 C84.2 C85.2 C86.1 J1.a1 J1.a3 J1.a5 J1.a8 J1.a9 J1.a10 J1.a11 J1.a12 J1.a13 J1.a14 J1.a15 J1.a16 J1.a17 J1.a18 J1.a19 J1.a20 J1.a22 J1.a23 J1.a24 J1.a25 J1.a26 J1.a27 J1.a28 J1.a29 J1.a30 J1.a31 J1.a32 J1.a33 J1.a34 J1.a35 J1.a36 J1.a37 J1.a38 J1.a39 J1.a40 J1.b2 J1.b4 J1.b6 J1.b8 J1.b9 J1.b11 J1.b12 J1.b14 J1.b15 J1.b17 J1.b18 J1.b20 J1.b22 J1.b23 J1.b24 J1.b25 J1.b26 J1.b27 J1.b28 J1.b29 J1.b30 J1.b31 J1.b32 J1.b33 J1.b34 J1.b35 J1.b37 J1.b38 J1.b40 J1.c1 J1.c3 J1.c5 J1.c8 J1.c9 J1.c11 J1.c12 J1.c14 J1.c15 J1.c17 J1.c18 J1.c20 J1.c22 J1.c23 J1.c24 J1.c25 J1.c26 J1.c27 J1.c28 J1.c29 J1.c30 J1.c31 J1.c32 J1.c33 J1.c34 J1.c35 J1.c37 J1.c38 J1.c40 J1.d2 J1.d4 J1.d6 J1.d8 J1.d9 J1.d10 J1.d11 J1.d12 J1.d13 J1.d14 J1.d15 J1.d16 J1.d17 J1.d18 J1.d19 J1.d20 J1.d22 J1.d23 J1.d24 J1.d25 J1.d26 J1.d27 J1.d28 J1.d29 J1.d30 J1.d31 J1.d32 J1.d33 J1.d34 J1.d35 J1.d36 J1.d37 J1.d38 J1.d39 J1.d40 J1.e1 J1.e3 J1.e5 J1.e8 J1.e9 J1.e10 J1.e11 J1.e12 J1.e13 J1.e14 J1.e15 J1.e16 J1.e17 J1.e18 J1.e19 J1.e20 J1.e22 J1.e23 J1.e24 J1.e25 J1.e26 J1.e27 J1.e28 J1.e29 J1.e30 J1.e31 J1.e32 J1.e33 J1.e34 J1.e35 J1.e36 J1.e37 J1.e38 J1.e39 J1.e40 J1.f2 J1.f4 J1.f6 J1.f8 J1.f10 J1.f11 J1.f13 J1.f14 J1.f16 J1.f17 J1.f19 J1.f20 J1.f22 J1.f23 J1.f24 J1.f25 J1.f26 J1.f27 J1.f28 J1.f29 J1.f30 J1.f31 J1.f32 J1.f33 J1.f34 J1.f36 J1.f37 J1.f39 J1.f40 J1.g1 J1.g3 J1.g5 J1.g8 J1.g10 J1.g11 J1.g13 J1.g14 J1.g16 J1.g17 J1.g19 J1.g20 J1.g22 J1.g23 J1.g24 J1.g25 J1.g26 J1.g27 J1.g28 J1.g29 J1.g30 J1.g31 J1.g32 J1.g33 J1.g34 J1.g36 J1.g37 J1.g39 J1.g40 J1.h2 J1.h4 J1.h6 J1.h8 J1.h9 J1.h10 J1.h11 J1.h12 J1.h13 J1.h14 J1.h15 J1.h16 J1.h17 J1.h18 J1.h19 J1.h20 J1.h22 J1.h23 J1.h24 J1.h25 J1.h26 J1.h27 J1.h28 J1.h29 J1.h30 J1.h31 J1.h32 J1.h33 J1.h34 J1.h35 J1.h36 J1.h37 J1.h38 J1.h39 J1.h40
P1V8: C78.2 C79.1 J1.a6 J1.c6
P3V3: C83.2 C84.1 C85.1 C86.2 J1.a7 J1.b7 J1.c7 J1.d7 J1.e7 J1.f7 J1.g7 J1.h7
P12V0: C80.2 C81.1 C82.1
ADCIO_0: J1.a2
ADCIO_1: J1.a4
ADCIO_2: J1.b1
ADCIO_3: J1.b3
ADCIO_4: J1.b5
ADCIO_5: J1.c2
ADCIO_6: J1.c4
ADCIO_7: J1.d1
ADCIO_8: J1.d3
ADCIO_9: J1.d5
ADCIO_10: J1.e2
ADCIO_11: J1.e4
ADCIO_12: J1.f1
ADCIO_13: J1.f3
ADCIO_14: J1.f5
ADCIO_15: J1.g2
ADCIO_16: J1.g4
ADCIO_17: J1.h1
ADCIO_18: J1.h3
ADCIO_19: J1.h5
ADCLK_IN0_N: J1.b36 ; port RFMC_ADCCLK_0_1.CLK0_N
ADCLK_IN0_P: J1.c36 ; port RFMC_ADCCLK_0_1.CLK0_P
ADCLK_IN1_N: J1.f35 ; port RFMC_ADCCLK_0_1.CLK1_N
ADCLK_IN1_P: J1.g35 ; port RFMC_ADCCLK_0_1.CLK1_P
ADCLK_IN2_N: J1.b39 ; port RFMC_ADCCLK_2_3.CLK0_N
ADCLK_IN2_P: J1.c39 ; port RFMC_ADCCLK_2_3.CLK0_P
ADCLK_IN3_N: J1.f38 ; port RFMC_ADCCLK_2_3.CLK1_N
ADCLK_IN3_P: J1.g38 ; port RFMC_ADCCLK_2_3.CLK1_P
RFMC_ADC_00_N: J1.f9 ; port RFMC_ADC.ADC0_IN_N  [project net ADC0_IN_N]
RFMC_ADC_00_P: J1.g9 ; port RFMC_ADC.ADC0_IN_P  [project net ADC0_IN_P]
RFMC_ADC_01_N: J1.b10 ; port RFMC_ADC.ADC1_IN_N  [project net ADC1_IN_N]
RFMC_ADC_01_P: J1.c10 ; port RFMC_ADC.ADC1_IN_P  [project net ADC1_IN_P]
RFMC_ADC_02_N: J1.f12 ; port RFMC_ADC.ADC2_IN_N  [project net ADC2_IN_N]
RFMC_ADC_02_P: J1.g12 ; port RFMC_ADC.ADC2_IN_P  [project net ADC2_IN_P]
RFMC_ADC_03_N: J1.b13 ; port RFMC_ADC.ADC3_IN_N  [project net ADC3_IN_N]
RFMC_ADC_03_P: J1.c13 ; port RFMC_ADC.ADC3_IN_P  [project net ADC3_IN_P]
RFMC_ADC_04_N: J1.f15 ; port RFMC_ADC.ADC4_IN_N  [project net ADC4_IN_N]
RFMC_ADC_04_P: J1.g15 ; port RFMC_ADC.ADC4_IN_P  [project net ADC4_IN_P]
RFMC_ADC_05_N: J1.b16 ; port RFMC_ADC.ADC5_IN_N  [project net ADC5_IN_N]
RFMC_ADC_05_P: J1.c16 ; port RFMC_ADC.ADC5_IN_P  [project net ADC5_IN_P]
RFMC_ADC_06_N: J1.f18 ; port RFMC_ADC.ADC6_IN_N  [project net ADC6_IN_N]
RFMC_ADC_06_P: J1.g18 ; port RFMC_ADC.ADC6_IN_P  [project net ADC6_IN_P]
RFMC_ADC_07_N: J1.b19 ; port RFMC_ADC.ADC7_IN_N  [project net ADC7_IN_N]
RFMC_ADC_07_P: J1.c19 ; port RFMC_ADC.ADC7_IN_P  [project net ADC7_IN_P]
RFMC_I2C_SCL: J1.g6 ; port RFMC_I2C.SCL
RFMC_I2C_SDA: J1.e6 ; port RFMC_I2C.SDA
VCM01_224: J1.a21 ; port ADC_VCM.VCM01_224
VCM01_225: J1.c21 ; port ADC_VCM.VCM01_225
VCM01_226: J1.e21 ; port ADC_VCM.VCM01_226
VCM01_227: J1.g21 ; port ADC_VCM.VCM01_227
VCM23_224: J1.b21 ; port ADC_VCM.VCM23_224
VCM23_225: J1.d21 ; port ADC_VCM.VCM23_225
VCM23_226: J1.f21 ; port ADC_VCM.VCM23_226
VCM23_227: J1.h21 ; port ADC_VCM.VCM23_227

### Buses and harness runs
bus ADCIO_[0..19] = port ADCIO_[0..19]

### Layout directives
differential pair: ADC0_IN_N, ADC0_IN_P, ADC1_IN_N, ADC1_IN_P, ADC2_IN_N, ADC2_IN_P, ADC3_IN_N, ADC3_IN_P, ADC4_IN_N, ADC4_IN_P, ADC5_IN_N, ADC5_IN_P, ADC6_IN_N, ADC6_IN_P, ADC7_IN_N, ADC7_IN_P, ADCLK_IN0_N, ADCLK_IN0_P, ADCLK_IN1_N, ADCLK_IN1_P, ADCLK_IN2_N, ADCLK_IN2_P, ADCLK_IN3_N, ADCLK_IN3_P

### Notes on the sheet
- I2C signals: LVCMOS 3.3V
- IO SE: LVCMOS  1.8V
- B1 ... B4
  screw holes for mounting the FmcAdc to the carrier board.
- Project/Equipment
- Document
- Designer
- Drawn by
- Check.by
- Copyright WUT ISE 2021
  This documentation describes Open Hardware and is licensed under CERN OHL v.1.1. You may redistribute and modify this documentaction under the terms of the CERN OHL v1.1.
  (http://ohwr.org/CERNOHL). This documentation is dristributed WITHOUT ANY EXPRESS OR IMPLIED WARRANTY, INCLUDING OF MERCHANTABLITY, SATISFACTORY QUALITY AND FITNESS FOR A PARTICULAR PURPOSE. Please see the CERN OHL v.1.1 for applicable conditions
- File
- Last Mod.
- Print Date
- Sheet
- Size
- A3
- of
- Rev
- Contact:

### Library data of the parts
B14-B16 = PLATED_HOLE2.7_PAD5.0: Single Terminal Socket; Part Description: Plated Through Hole: Hole Dia.=2.7mm Pad Dia.=5.0mm; Mounted: No; Part Number: PLATED_HOLE2.7_PAD5.0; Component Kind: Standard (No BOM); Component Type: Standard (No BOM); Pin Count: 1; Family: Plated Hole; Socket: No; SMD: No; Sense: No; Status: None; ComponentHeight: 0mm; HelpURL: Undefined; Author: CERN DEM JMW; CreateDate: 27.09.2011; LatestRevisionDate: 27.09.2011; PackageDescription: Plated Through Hole: Hole Dia.=2.7mm Pad Dia.=5.0mm
C78 C80 C83 = CC0603_10UF_10V_10%_X5R: Non-polarised capacitor; Part Description: SMD Multilayer Chip Ceramic Capacitor; Manufacturer: GENERIC; Manufacturer1 Part Number: GRM188R61A106KE69D; Voltage: 10V; TC: X5R; Tolerance: ±10%; Part Number: CC0603_10UF_10V_10%_X5R; Component Kind: Standard; Component Type: Standard; Pin Count: 2; Value: 10uF; Status: None; Manufacturer Part Number: CC0603_10UF_10V_10%_X5R; Case: 0603; Mounted: Yes; Socket: No; SMD: Yes; Sense: No; Manufacturer1 Example: MURATA; Manufacturer1 ComponentHeight: 0.8mm; HelpURL: \\cern.ch\dfs\Applications\Altium\Datasheets\CC0603_MURATA_GRM188R61A106KE69D.pdf; Author: CERN DEM JLC; CreateDate: 31.01.2017; LatestRevisionDate: 31.01.2017
C79 C81 C82 C84 C85 = CC0402_1UF_16V_10%_X5R: Non-polarised capacitor; Part Description: SMD Multilayer Chip Ceramic Capacitor; Manufacturer: GENERIC; Manufacturer1 Part Number: C1005X5R1C105KT; Voltage: 16V; TC: X5R; Tolerance: ±10%; Part Number: CC0402_1UF_16V_10%_X5R; Component Kind: Standard; Component Type: Standard; Pin Count: 2; Value: 1uF; Status: Preferred; Manufacturer Part Number: CC0402_1UF_16V_10%_X5R; Case: 0402; Mounted: Yes; Socket: No; SMD: Yes; Sense: No; Manufacturer1 Example: TDK; Manufacturer1 ComponentHeight: 0.55mm; HelpURL: \\cern.ch\dfs\Applications\Altium\Datasheets\CC0402_X5R_TDK_C.pdf; Author: CERN DEM JLC; CreateDate: 25.10.2012; LatestRevisionDate: 25.10.2012
C86 = CC1206_100UF_6.3V_20%_X5R: Non-polarised capacitor; Part Description: SMD Multilayer Chip Ceramic Capacitor; Manufacturer: GENERIC; Manufacturer1 Part Number: C1206C107M9PACTU; Voltage: 6.3V; Tolerance: ±10%; TC: X5R; Part Number: CC1206_100UF_6.3V_20%_X5R; Component Kind: Standard; Component Type: Standard; Pin Count: 2; Value: 100uF; Status: None; Manufacturer Part Number: CC1206_100UF_6.3V_20%_X5R; Case: 1206; Mounted: Yes; Socket: No; SMD: Yes; Sense: No; Manufacturer1 Example: KEMET; Manufacturer1 ComponentHeight: 1.8mm; HelpURL: \\cern.ch\dfs\Applications\Altium\Datasheets\CC1206_X5R_KEMET.pdf; Author: CERN DEM JLC; CreateDate: 26.09.2012; LatestRevisionDate: 26.09.2012
J1 = SAMTEC_LPAF-40-03.0-S-08-2-K: Connector 320 Female contacts in 8 row abcdef; Part Description: 320 Contacts (8x40), Pitch 1.27mm, Straight High Speed Low-Profile Open-Pin-Field Socket; Manufacturer: SAMTEC; PressFit: No; Sense Comment: Solder Paste Deposition Sensitive – Check Manufacturer Recommendations for Stencil Design; Part Number: SAMTEC_LPAF-40-03.0-S-08-2-K; Component Kind: Standard; Component Type: Standard; Pin Count: 320; Mounted: Yes; Socket: No; SMD: Yes; Sense: Yes; Status: None; Manufacturer Part Number: LPAF-40-03.0-S-08-2-K; ComponentHeight: 2.79mm; HelpURL: \\cern.ch\dfs\Applications\Altium\Datasheets\SAMTEC_LPAF-40-03.0-S-08-2-K.pdf; Author: CERN DEM BC; CreateDate: 02.12.2020; LatestRevisionDate: 02.12.2020